# EasyEDA Pro project ProPrj_E24_5.0.epro, board PCB
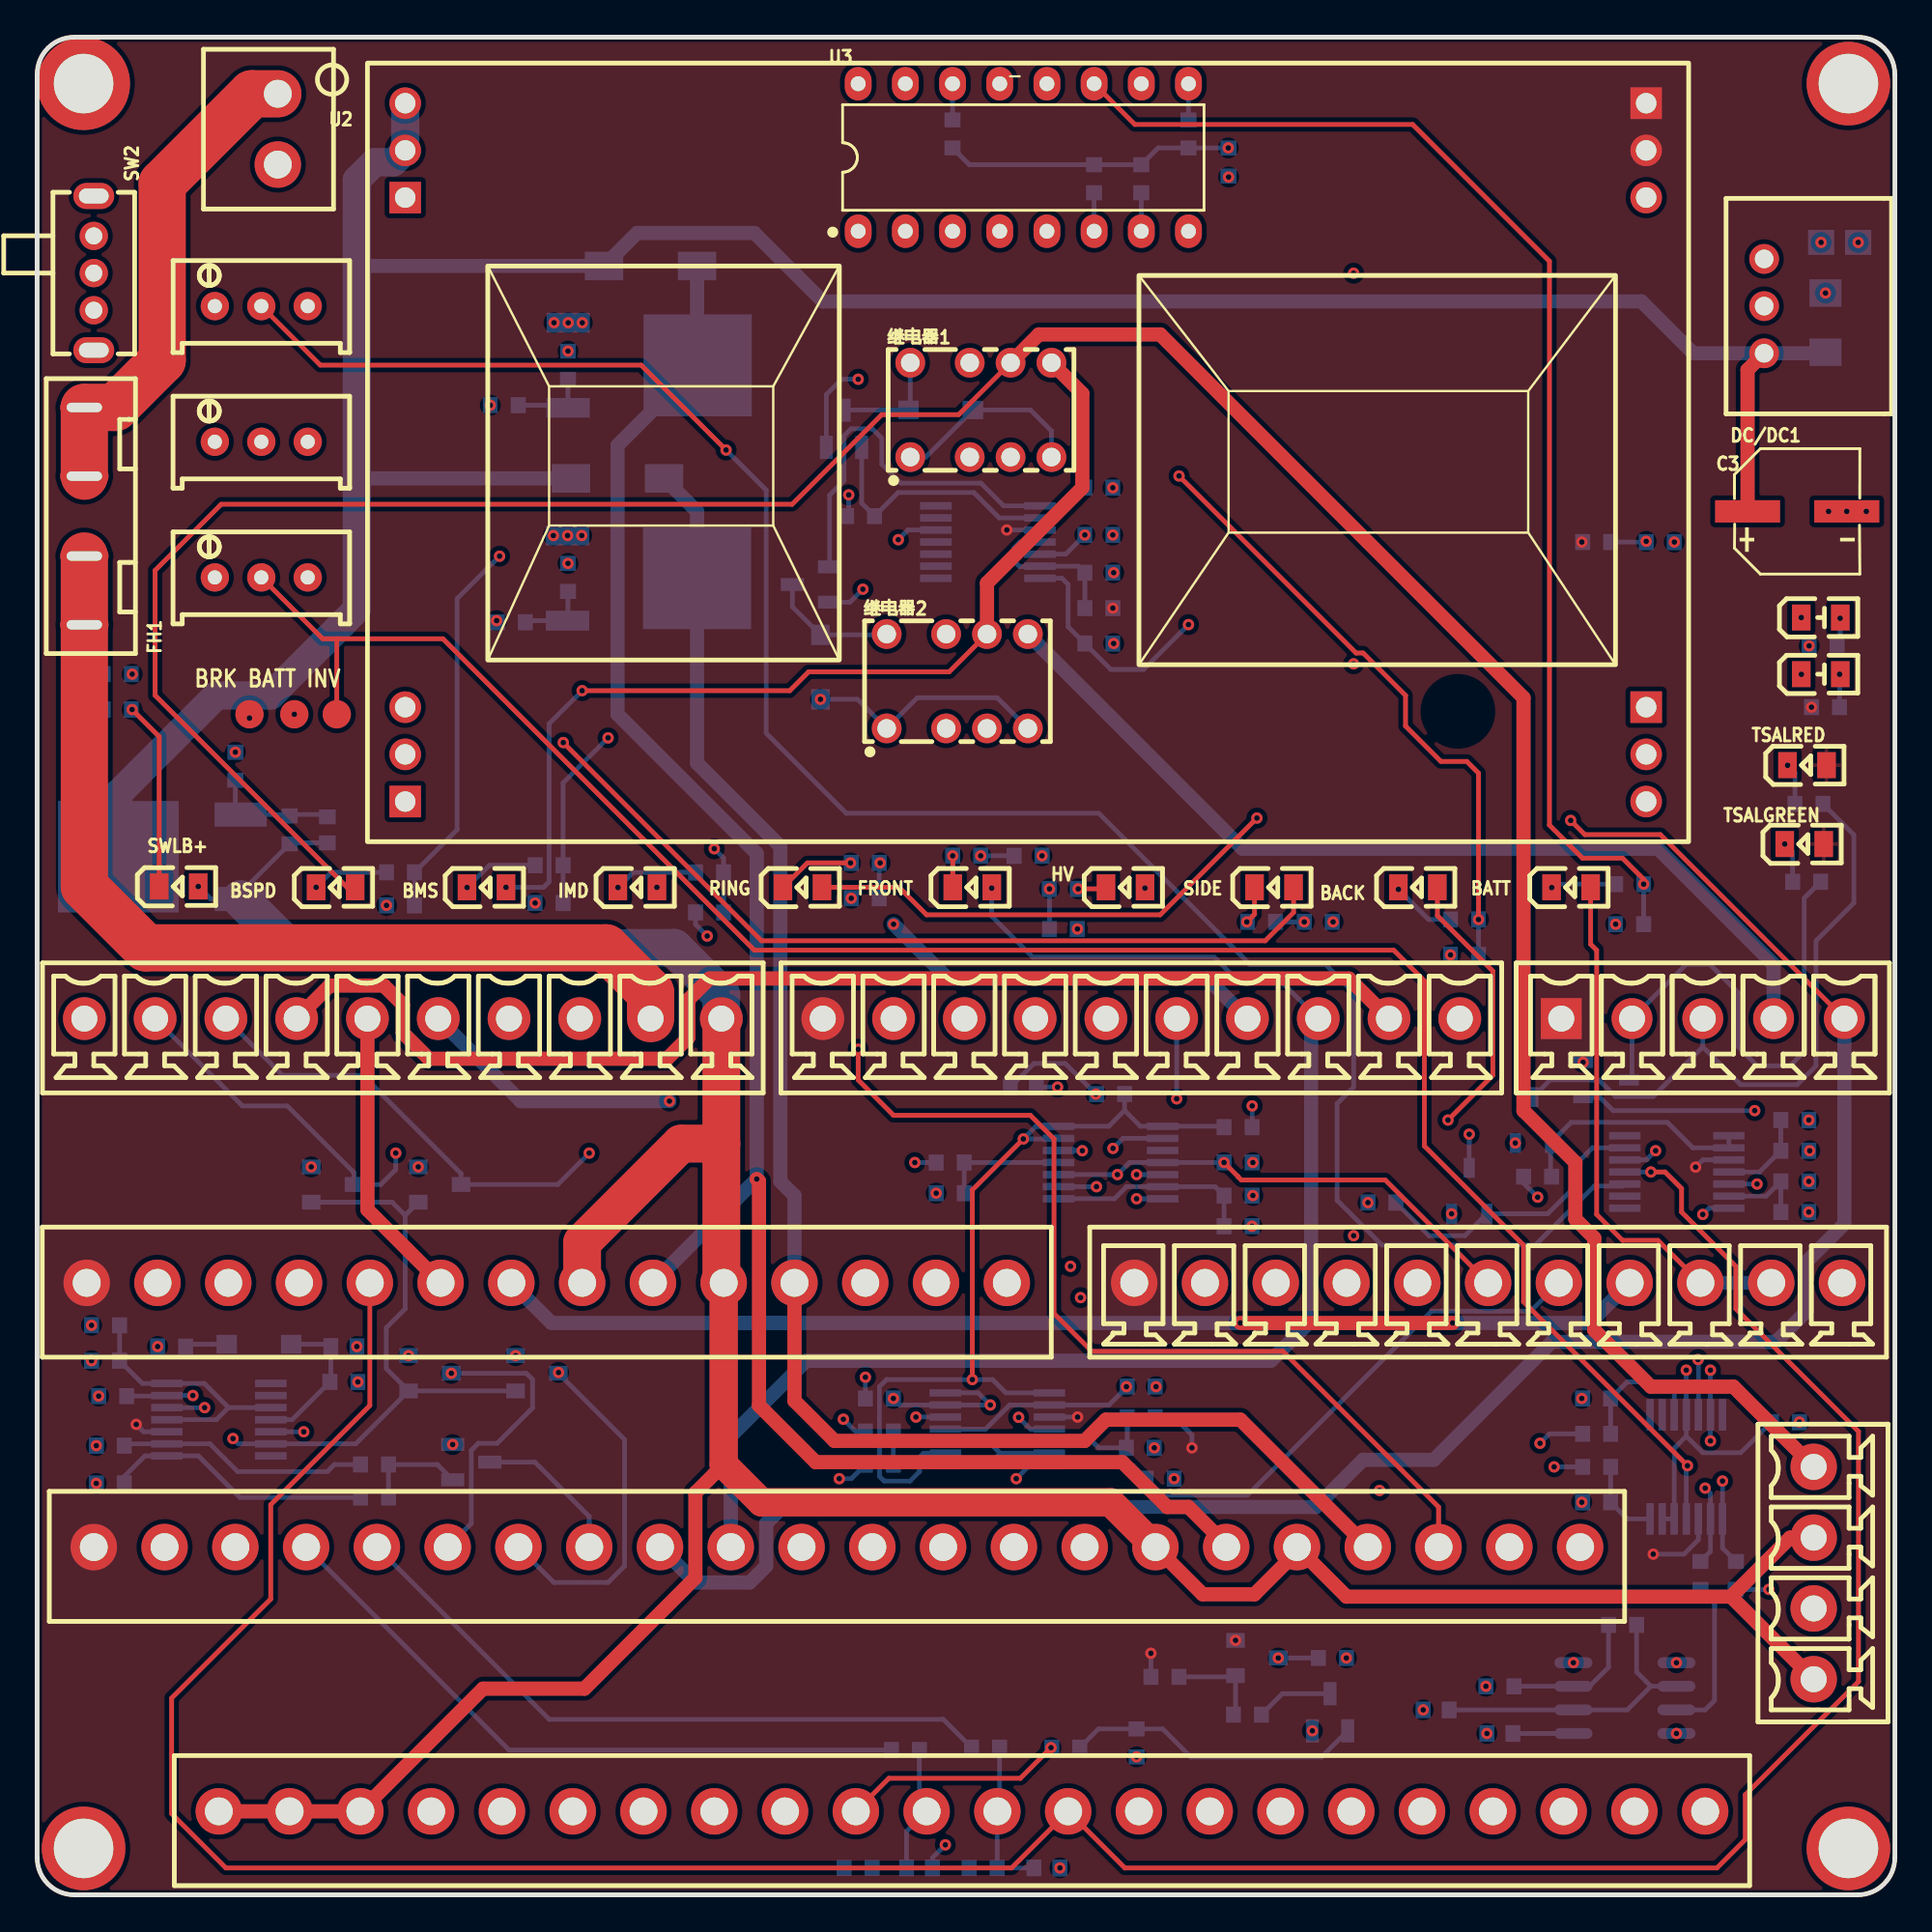
[diagram p3: board, top side]
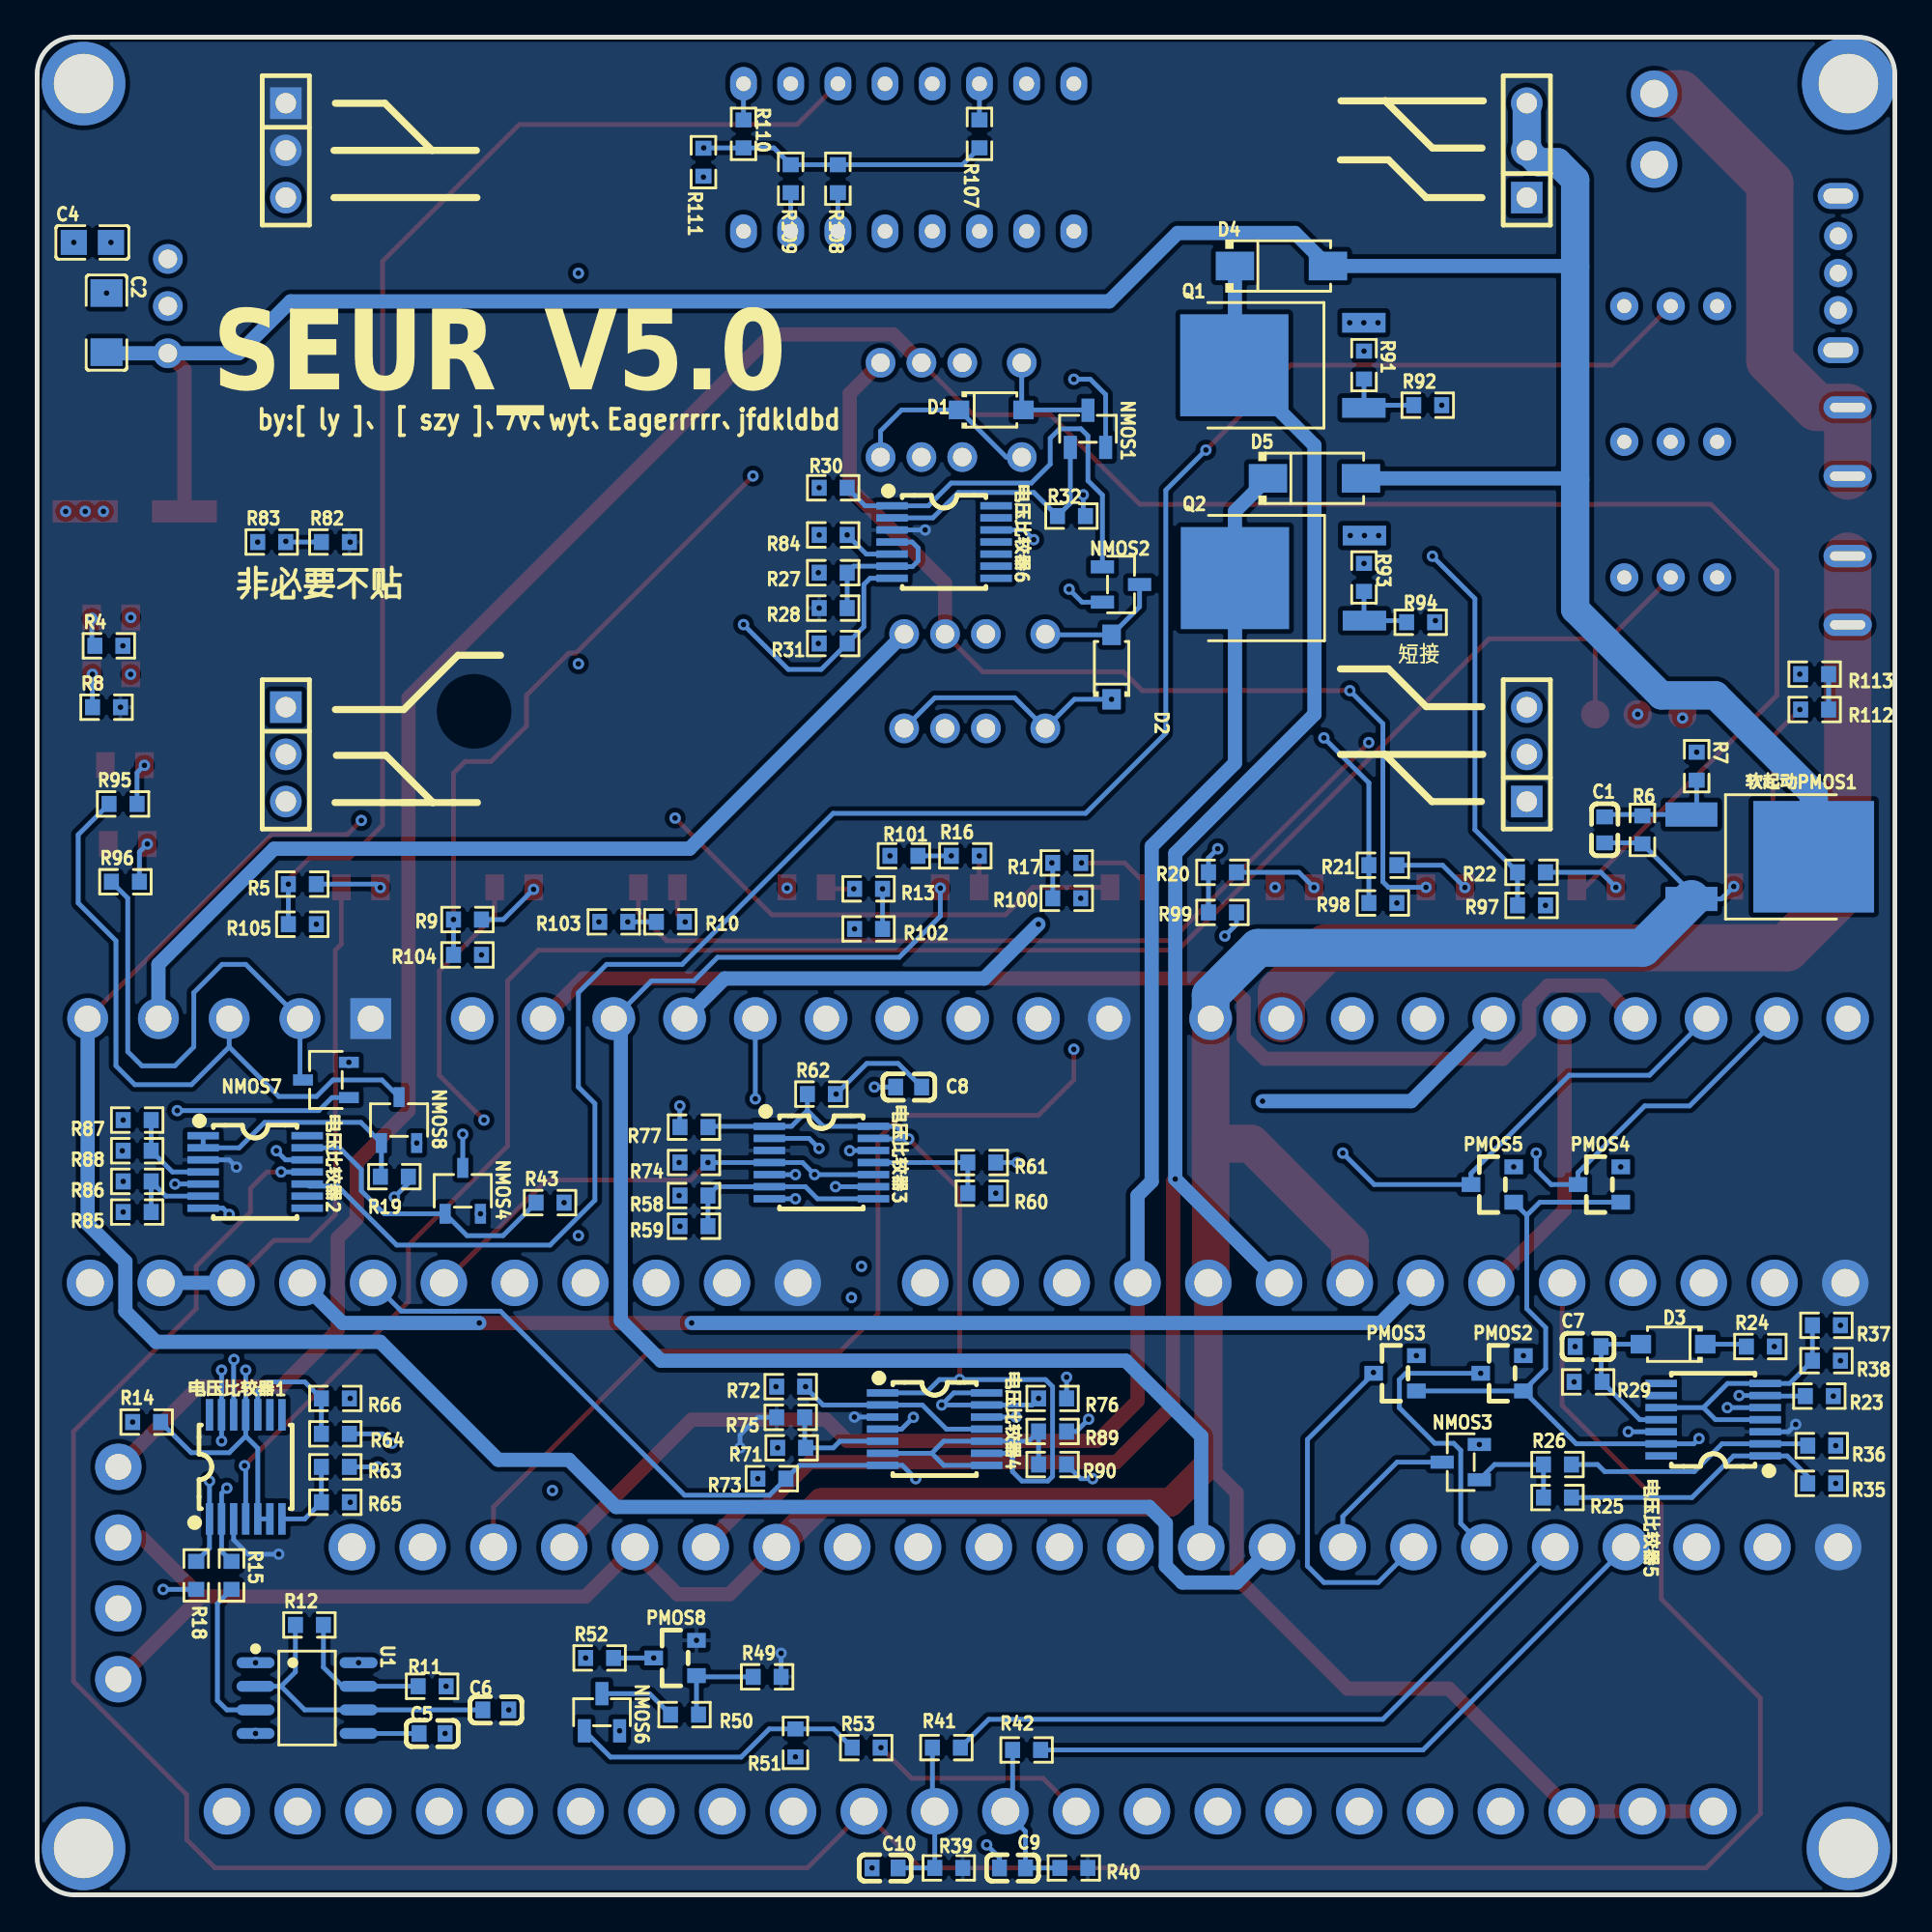
[diagram p4: board, bottom side, seen from below]

Outline 100 x 100 mm; copper layers: Top Layer, Inner1, Inner2, Bottom Layer. Coordinates in mm from the lower left corner of the outline.
Outline path: 0,98 0,2 arc(0.59,0.59) 2,0 98,0 arc(99.41,0.59) 100,2 100,98 arc(99.41,99.41) 98,100 2,100 arc(0.59,99.41) 0,98
Stack: Top Layer 0.035mm 外层铜厚1oz / Dielectric1 0.2104mm 7628 RC49% 8.6mil / Inner1 0.0152mm 内层铜厚 / Dielectric2 1.065mm 1.1mm H/HOZ Copper / Inner2 0.0152mm 内层铜厚 / Dielectric3 0.2104mm 7628 RC49% 8.6mil / Bottom Layer 0.035mm 外层铜厚1oz

## Design rules (mm)
template: JLCPCB Capability(Two Layers Board)
spacing copperThickness1oz (default): track to track 0.102, other pairs 0.152 to 0.3
spacing copperThickness2oz: track to track 0.203, other pairs 0.152 to 0.3
track width copperThickness1oz (default): min 0.127, default 0.254, max 2.54
track width copperThickness2oz: min 0.203, default 0.254, max 2.54
differential pair differentialPair (default): width min 0.127, default 0.254, max 2.54; gap min 0.152, default 0.152
via viaSize (default): diameter min 0.5, default 0.61, max 10; hole min 0.3, default 0.305, max 6.3

## Placement (name value [footprint] x y rotation side)
BACK  09  [LED0805-R-RD]  74.32 54.23 0 top
BATT  10  [LED0805-R-RD]  82.57 54.23 0 top
BMS  03  [LED0805-R-RD]  24.19 54.23 0 top
BSPD  02  [LED0805-R-RD]  16.07 54.23 0 top
C1  10uF  [C0603]  15.62 57.33 270 bottom
C2  10uF  [C1206]  96.27 84.63 270 bottom
C3  33uF  [CAP-SMD_BD6.3-L6.6-W6.6-FD]  94.74 74.47 0 top
C4  22uF  [C0805]  97.03 88.95 180 bottom
C5  10nF  [C0603]  78.74 8.69 0 bottom
C6  1uF  [C0603]  75.31 9.96 0 bottom
C7  10uF  [C0603]  16.51 29.51 180 bottom
C8  1uF  [C0603]  53.09 43.48 0 bottom
C9  10uF  [C0603]  47.5 1.45 0 bottom
C10  10uF  [C0603]  54.36 1.45 0 bottom
CN1  PLUG_FRONT  [CONN-TH_22P-P3.81_DB2EVC-3.81-22P-GN]  43.05 18.72 0 top
CN2  PLUG_BACK  [CONN-TH_14P-P3.81_DB2EVC-3.81-14P-GN]  27.43 32.94 0 top
CN4  PLUG_RING  [CONN-TH_5P-P3.81_DB2EVC-3.81-5P]  89.66 47.17 0 top
CN5  PLUG_SIDE  [CONN-TH_10P-P3.81_DB2EVC-3.81-10P]  19.69 47.17 0 top
CN6  PLUG_BATT  [CONN-TH_11P-P3.81_DB2EVC-3.81-11P-GN]  78.1 32.94 0 top
CN7  LOW_BATT  [CONN-TH_2P-P3.81_DB2EVC-3.81-2P-BK]  12.95 95.05 270 top
CN9  PLUG_BSPD  [CONN-TH_4P-P3.81_DB2EVC-3.81-4P]  95.63 17.32 90 top
CN10  PLUG_VCU  [CONN-TH_22P-P3.81_DB2EVC-3.81-22P-GN]  49.78 4.5 0 top
CN11  PLUG_HV  [CONN-TH_10P-P3.81_DB2EVC-3.81-10P]  59.44 47.17 0 top
D1  1N4148W  [SOD-123F_L2.7-W1.6-LS3.8-RD]  48.64 79.93 180 bottom
D2  1N4148W  [SOD-123F_L2.7-W1.6-LS3.8-RD]  42.16 66.09 90 bottom
D3  1N4148W  [SOD-123F_L2.7-W1.6-LS3.8-RD]  11.94 29.64 0 bottom
D4  SS54  [SMA_L4.4-W2.8-LS5.4-R-RD]  33.02 87.68 180 bottom
D5  SS54  [SMA_L4.4-W2.8-LS5.4-R-RD]  31.24 76.25 180 bottom
DC/DC1  K7805-2000R3  [PWRM-TH_DEXU_K78XX-2000R3]  92.96 85.52 90 top
FH1  FUSE  [FUSE-TH_XF-506P]  2.54 74.22 90 top
FRONT  06  [LED0805-R-RD]  50.34 54.23 0 top
HV  07  [LED0805-R-RD]  58.59 54.23 0 top
IMD  04  [LED0805-R-RD]  32.31 54.23 0 top
LED1  +5V  [LED0805-R-RD_BLUE]  96.01 68.76 0 top
LED2  +24V  [LED0805-R-RD_BLUE]  96.01 65.71 0 top
NMOS1  2N7002  [SOT-23-3_L2.9-W1.3-P1.90-LS2.4-BR]  43.43 78.92 270 bottom
NMOS2  2N7002  [SOT-23-3_L2.9-W1.3-P1.90-LS2.4-BR]  41.66 70.54 0 bottom
NMOS3  2N7002  [SOT-23-3_L2.9-W1.3-P1.90-LS2.4-BR]  23.37 23.29 180 bottom
NMOS4  WST4040  [SOT-23-3_L2.9-W1.6-P1.90-LS2.8-BR]  77.09 37.9 270 bottom
NMOS6  2N7002  [SOT-23-3_L2.9-W1.3-P1.90-LS2.4-BR]  69.6 9.83 270 bottom
NMOS7  WST4040  [SOT-23-3_L2.9-W1.6-P1.90-LS2.8-BR]  84.46 43.87 180 bottom
NMOS8  WST4040  [SOT-23-3_L2.9-W1.6-P1.90-LS2.8-BR]  80.52 41.71 270 bottom
NOREF  -  [Pad_e325]  97.5 97.5 0 top
NOREF#2  -  [Pad_e121]  13.84 63.55 0 top
NOREF#3  -  [Pad_e326]  2.5 2.5 0 top
NOREF#4  -  [Pad_e327]  97.5 2.5 0 top
NOREF#5  -  [Pad_e38]  16.13 63.55 0 top
NOREF#6  -  [Pad_e122]  11.43 63.55 0 top
NOREF#7  -  [Pad_e324]  2.5 97.5 0 top
PMOS2  LBSS84LT1G  [SOT-23_L2.9-W1.3-P1.90-LS2.4-BR]  21.14 28.08 180 bottom
PMOS3  LBSS84LT1G  [SOT-23_L2.9-W1.3-P1.90-LS2.4-BR]  26.91 28.08 180 bottom
PMOS4  LBSS84LT1G  [SOT-23_L2.9-W1.3-P1.90-LS2.4-BR]  15.9 38.24 180 bottom
PMOS5  LBSS84LT1G  [SOT-23_L2.9-W1.3-P1.90-LS2.4-BR]  21.67 38.24 180 bottom
PMOS8  LBSS84LT1G  [SOT-23_L2.9-W1.3-P1.90-LS2.4-BR]  65.66 12.75 180 bottom
Q1  STN454D  [TO-252-2_L6.5-W6.1-P4.58-LS10.0-BR]  32.07 82.34 180 bottom
Q2  STN454D  [TO-252-2_L6.5-W6.1-P4.58-LS10.0-BR]  32.04 70.88 180 bottom
R4  2kΩ  [R0603]  96.14 67.23 180 bottom
R5  10kΩ  [R0603]  85.72 54.41 180 bottom
R6  150kΩ  [R0603]  13.59 57.33 270 bottom
R7  150kΩ  [R0603]  10.67 60.76 270 bottom
R8  10kΩ  [R0603]  96.27 63.93 180 bottom
R9  10kΩ  [R0603]  76.84 52.5 180 bottom
R10  10kΩ  [R0603]  65.91 52.38 180 bottom
R11  22kΩ  [R0603]  78.74 11.23 180 bottom
R12  220kΩ  [R0603]  85.34 14.53 180 bottom
R13  10kΩ  [R0603]  55.25 54.15 0 bottom
R14  100kΩ  [R0603]  94.11 25.45 180 bottom
R15  100kΩ  [R0603]  89.53 17.2 270 bottom
R16  10kΩ  [R0603]  50.04 55.93 180 bottom
R17  10kΩ  [R0603]  44.58 55.55 180 bottom
R18  10kΩ  [R0603]  91.44 17.2 270 bottom
R19  100kΩ  [R0603]  80.77 38.66 180 bottom
R20  10kΩ  [R0603]  36.19 55.04 180 bottom
R21  10kΩ  [R0603]  27.56 55.42 180 bottom
R22  10kΩ  [R0603]  19.56 55.04 180 bottom
R23  10kΩ  [R0603]  4.06 26.85 180 bottom
R24  680Ω  [R0603]  7.24 29.51 180 bottom
R25  300kΩ  [R0603]  18.16 21.39 0 bottom
R26  300kΩ  [R0603]  18.16 23.16 180 bottom
R27  300kΩ  [R0603]  57.15 71.17 180 bottom
R28  100kΩ  [R0603]  57.15 69.27 0 bottom
R29  100kΩ  [R0603]  16.51 27.61 0 bottom
R30  100kΩ  [R0603]  57.15 75.74 0 bottom
R31  100kΩ  [R0603]  57.15 67.36 180 bottom
R32  100kΩ  [R0603]  44.32 74.22 180 bottom
R35  100kΩ  [R0603]  3.94 22.15 180 bottom
R36  100kΩ  [R0603]  3.94 24.18 180 bottom
R37  10kΩ  [R0603]  3.68 30.66 0 bottom
R38  1kΩ  [R0603]  3.68 28.75 180 bottom
R39  2kΩ  [R0603]  50.93 1.45 180 bottom
R40  2kΩ  [R0603]  44.2 1.45 180 bottom
R41  20Ω  [R0603]  51.05 7.93 0 bottom
R42  20Ω  [R0603]  46.74 7.8 0 bottom
R43  100kΩ  [R0603]  72.39 37.26 180 bottom
R49  10kΩ  [R0603]  60.71 11.74 180 bottom
R50  10kΩ  [R0603]  65.15 9.7 180 bottom
R51  10kΩ  [R0603]  59.18 8.18 90 bottom
R52  20kΩ  [R0603]  69.72 12.75 180 bottom
R53  10kΩ  [R0603]  55.37 7.93 180 bottom
R58  330Ω  [R0603]  64.64 37.64 180 bottom
R59  10kΩ  [R0603]  64.64 35.99 0 bottom
R60  10kΩ  [R0603]  49.15 37.77 0 bottom
R61  1kΩ  [R0603]  49.15 39.42 180 bottom
R62  330kΩ  [R0603]  57.78 43.1 180 bottom
R63  1kΩ  [R0603]  83.95 23.04 180 bottom
R64  10kΩ  [R0603]  83.95 24.82 180 bottom
R65  10kΩ  [R0603]  83.95 21.13 0 bottom
R66  330Ω  [R0603]  83.95 26.72 0 bottom
R71  300kΩ  [R0603]  59.39 24.06 180 bottom
R72  10kΩ  [R0603]  59.44 27.36 0 bottom
R73  100kΩ  [R0603]  60.45 22.4 180 bottom
R74  100kΩ  [R0603]  64.64 39.42 180 bottom
R75  100kΩ  [R0603]  59.44 25.71 0 bottom
R76  100kΩ  [R0603]  45.34 26.72 180 bottom
R77  10kΩ  [R0603]  64.64 41.33 0 bottom
R82  ？  [R0603]  83.95 72.82 180 bottom
R83  ？  [R0603]  87.38 72.82 180 bottom
R84  300kΩ  [R0603]  57.15 73.2 180 bottom
R85  1kΩ  [R0603]  94.62 36.75 0 bottom
R86  10kΩ  [R0603]  94.62 38.41 180 bottom
R87  10kΩ  [R0603]  94.62 41.71 0 bottom
R88  330Ω  [R0603]  94.62 40.06 180 bottom
R89  1kΩ  [R0603]  45.34 24.94 180 bottom
R90  10kΩ  [R0603]  45.34 23.16 0 bottom
R91  10kΩ  [R0603]  28.57 82.35 270 bottom
R92  10kΩ  [R0603]  25.15 80.19 180 bottom
R93  10kΩ  [R0603]  28.57 70.92 270 bottom
R94  ？  [R0603]  25.53 68.5 180 bottom
R95  10kΩ  [R0603]  95.38 58.72 180 bottom
R96  10kΩ  [R0603]  95.25 54.53 180 bottom
R97  2kΩ  [R0603]  19.56 53.26 0 bottom
R98  2kΩ  [R0603]  27.56 53.39 0 bottom
R99  2kΩ  [R0603]  36.19 52.88 0 bottom
R100  2kΩ  [R0603]  44.58 53.64 0 bottom
R101  2kΩ  [R0603]  53.34 55.93 180 bottom
R102  2kΩ  [R0603]  55.25 51.99 180 bottom
R103  2kΩ  [R0603]  68.96 52.38 180 bottom
R104  2kΩ  [R0603]  76.84 50.6 0 bottom
R105  2kΩ  [R0603]  85.72 52.25 0 bottom
R107  10kΩ  [R0603]  49.28 94.79 90 bottom
R108  20kΩ  [R0603]  56.9 92.38 90 bottom
R109  40kΩ  [R0603]  59.44 92.38 90 bottom
R110  80kΩ  [R0603]  61.98 94.79 270 bottom
R111  100kΩ  [R0603]  64.13 93.27 90 bottom
R112  10kΩ  [R0603]  4.32 63.81 0 bottom
R113  2kΩ  [R0603]  4.32 65.71 180 bottom
RING  05  [LED0805-R-RD]  41.19 54.23 0 top
SIDE  08  [LED0805-R-RD]  66.58 54.23 0 top
SW2  SK12D07VG4  [SW-TH_SK12D07VG4]  3.05 87.3 270 top
SWLB+  02  [LED0805-R-RD]  7.62 54.28 0 top
TSALGREEN  NCD0805G1  [LED0805-R-RD]  95.12 56.57 0 top
TSALRED  NCD0805R1  [LED0805-R-RD]  95.27 60.81 0 top
U1  -  [SOIC-8_L4.9-W3.9-P1.27-LS6.0-BL]  85.47 10.59 270 bottom
U2  -  [DCDC_b_package]  17.78 98.6 0 top
U3  SN74LS147N(LX)  [PDIP-16_L19.3-W6.4-P2.54-LS7.94-BL]  53.09 93.52 0 top
可调电阻1  10kΩ  [RES-ADJ-TH_3P-L10.0-W10.0-P2.50-L]  12.06 78.22 0 top
可调电阻2  10kΩ  [RES-ADJ-TH_3P-L10.0-W10.0-P2.50-L]  12.06 70.92 0 top
可调电阻3  10kΩ  [RES-ADJ-TH_3P-L10.0-W10.0-P2.50-L]  12.06 85.52 0 top
电压比较器1  LM339PT  [TSSOP-14_L5.0-W4.4-P0.65-LS6.4-BL]  88.77 23.04 180 bottom
电压比较器2  LM339PT  [TSSOP-14_L5.0-W4.4-P0.65-LS6.4-BL]  88.26 38.91 270 bottom
电压比较器3  LM339PT  [TSSOP-14_L5.0-W4.4-P0.65-LS6.4-BL]  57.78 39.42 270 bottom
电压比较器4  LM339PT  [TSSOP-14_L5.0-W4.4-P0.65-LS6.4-BL]  51.69 25.07 270 bottom
电压比较器5  LM339PT  [TSSOP-14_L5.0-W4.4-P0.65-LS6.4-BL]  9.78 25.58 90 bottom
电压比较器6  LM339PT  [TSSOP-14_L5.0-W4.4-P0.65-LS6.4-BL]  51.18 72.82 270 bottom
继电器1  BMS  [RELAY-TH_HFDXXX]  50.8 79.93 0 top
继电器2  IMD  [RELAY-TH_HFDXXX]  49.53 65.33 0 top
软起动PMOS1  NCE40P70K  [TO-252-2_L6.6-W6.1-P4.57-LS9.9-TL-CW]  7.66 55.88 180 bottom

## Footprints (pads in the part's own frame, mm; a bottom-side part is the same pattern mirrored in y, then rotated)
C0603
  rect 0.8x0.9 smd: 1(-0.7,0) 2(0.7,0)
C0805
  rect 1.41x1.35 smd: 1(-1,0) 2(1,0)
C1206
  rect 1.485x1.728 smd: 1(-1.593,0) 2(1.593,0)
CAP-SMD_BD6.3-L6.6-W6.6-FD
  rect 3.5x1.2 smd: 1(-2.67,0) 2(2.67,0)
CONN-TH_2P-P3.81_DB2EVC-3.81-2P-BK
  round 2.5 hole 1.5: 1(-1.905,0) 2(1.905,0)
CONN-TH_4P-P3.81_DB2EVC-3.81-4P
  round 2.5 hole 1.4: 1(-5.715,0) 2(-1.905,0) 3(1.905,0) 4(5.715,0)
CONN-TH_5P-P3.81_DB2EVC-3.81-5P
  rect 2.2x2.2 hole 1.4: 1(-7.62,0)
  round 2.2 hole 1.4: 2(-3.81,0) 3(0,0) 4(3.81,0) 5(7.62,0)
CONN-TH_10P-P3.81_DB2EVC-3.81-10P
  round 2.3 hole 1.4: 1(-17.145,0) 2(-13.335,0) 3(-9.525,0) 4(-5.715,0) 5(-1.905,0) 6(1.905,0) 7(5.715,0) 8(9.525,0) 9(13.335,0) 10(17.145,0)
CONN-TH_11P-P3.81_DB2EVC-3.81-11P-GN
  round 2.5 hole 1.5: 1(-19.05,0) 2(-15.24,0) 3(-11.43,0) 4(-7.62,0) 5(-3.81,0) 6(0,0) 7(3.81,0) 8(7.62,0) 9(11.43,0) 10(15.24,0) 11(19.05,0)
CONN-TH_14P-P3.81_DB2EVC-3.81-14P-GN
  round 2.5 hole 1.5: 1(-24.765,0) 2(-20.955,0) 3(-17.145,0) 4(-13.335,0) 5(-9.525,0) 6(-5.715,0) 7(-1.905,0) 8(1.905,0) 9(5.715,0) 10(9.525,0) 11(13.335,0) 12(17.145,0) 13(20.955,0) 14(24.765,0)
CONN-TH_22P-P3.81_DB2EVC-3.81-22P-GN
  round 2.5 hole 1.5: 1(-40.005,0) 2(-36.195,0) 3(-32.385,0) 4(-28.575,0) 5(-24.765,0) 6(-20.955,0) 7(-17.145,0) 8(-13.335,0) 9(-9.525,0) 10(-5.715,0) 11(-1.905,0) 12(1.905,0) 13(5.715,0) 14(9.525,0) 15(13.335,0) 16(17.145,0) 17(20.955,0) 18(24.765,0) 19(28.575,0) 20(32.385,0) 21(36.195,0) 22(40.005,0)
DCDC_b_package
  round 1.7 hole 1.1: 1(2.032,-2.159) 2(2.032,-4.699) 4(2.032,-34.671) 5(2.032,-37.211) 8(68.834,-4.699) 9(68.834,-7.239) 11(68.834,-37.211) 12(68.834,-39.751)
  rect 1.7x1.7 hole 1.1: 3(2.032,-7.239) 6(2.032,-39.751) 7(68.834,-2.159) 10(68.834,-34.671)
FUSE-TH_XF-506P
  oval 1.2x2.6 hole 0.5x1.9: 1(-5.85,0) 1(-2.15,0) 2(2.15,0) 2(5.85,0)
LED0805-R-RD
  rect 1x1.399 smd: 1(1.05,0) 2(-1.05,0)
LED0805-R-RD_BLUE
  rect 1x1.399 smd: 1(1.05,0) 2(-1.05,0)
Pad_e38
  round 1.524 smd: 1(0,0)
Pad_e121
  round 1.524 smd: 1(0,0)
Pad_e122
  round 1.524 smd: 1(0,0)
Pad_e324
  round 5 hole 3.2: 1(0,0)
Pad_e325
  round 4.5 hole 3.2: 2(0,0)
Pad_e326
  round 4.5 hole 3.2: 3(0,0)
Pad_e327
  round 4.5 hole 3.2: 4(0,0)
PDIP-16_L19.3-W6.4-P2.54-LS7.94-BL
  oval 1.44x1.8 hole 0.8: 1(-8.89,-3.97) 2(-6.35,-3.97) 3(-3.81,-3.97) 4(-1.27,-3.97) 5(1.27,-3.97) 6(3.81,-3.97) 7(6.35,-3.97) 8(8.89,-3.97) 9(8.89,3.97) 10(6.35,3.97) 11(3.81,3.97) 12(1.27,3.97) 13(-1.27,3.97) 14(-3.81,3.97) 15(-6.35,3.97) 16(-8.89,3.97)
PWRM-TH_DEXU_K78XX-2000R3
  round 1.6 hole 1: 1(-2.54,0) 2(0,0) 3(2.54,0)
R0603
  rect 0.806x0.864 smd: 1(-0.753,0) 2(0.753,0)
RELAY-TH_HFDXXX
  round 1.6 hole 1: 1(-3.8,-2.54) 2(-0.6,-2.54) 3(1.6,-2.54) 4(3.8,-2.54) 5(3.8,2.54) 6(1.6,2.54) 7(-0.6,2.54) 8(-3.8,2.54)
RES-ADJ-TH_3P-L10.0-W10.0-P2.50-L
  round 1.524 hole 0.762: 1(-2.5,0) 2(0,0) 3(2.5,0)
SMA_L4.4-W2.8-LS5.4-R-RD
  rect 2.062x1.539 smd: 1(2.503,0) 2(-2.503,0)
SOD-123F_L2.7-W1.6-LS3.8-RD
  rect 1.1x1 smd: 1(-1.735,0) 2(1.735,0)
SOIC-8_L4.9-W3.9-P1.27-LS6.0-BL
  oval 0.588x2.045 smd: 1(-1.905,-2.772) 2(-0.635,-2.772) 3(0.635,-2.772) 4(1.905,-2.772) 5(1.905,2.772) 6(0.635,2.772) 7(-0.635,2.772) 8(-1.905,2.772)
SOT-23-3_L2.9-W1.3-P1.90-LS2.4-BR
  rect 1.25x0.7 smd: 1(1,-0.95) 2(1,0.95) 3(-1,0)
SOT-23-3_L2.9-W1.6-P1.90-LS2.8-BR
  rect 1.07x0.6 smd: 1(1.235,-0.95) 2(1.235,0.95) 3(-1.235,0)
SOT-23_L2.9-W1.3-P1.90-LS2.4-BR
  rect 1x0.8 smd: 1(1.15,-0.95) 2(1.15,0.95) 3(-1.15,0)
SW-TH_SK12D07VG4
  round 1.524 hole 0.914: 1(-2,0) 2(0,0) 3(2,0)
  oval 1.4x2.2 hole 0.8x1.6: 4(4.15,0) 5(-4.15,0)
TO-252-2_L6.5-W6.1-P4.58-LS10.0-BR
  rect 2.336x1.064 smd: 1(3.486,-2.29) 3(3.486,2.29)
  rect 5.826x5.491 smd: 4(-3.486,0)
TO-252-2_L6.6-W6.1-P4.57-LS9.9-TL-CW
  rect 2.8x1.3 smd: 1(-3.292,2.273) 3(-3.292,-2.273)
  rect 6.5x6 smd: 2(3.292,0)
TSSOP-14_L5.0-W4.4-P0.65-LS6.4-BL
  rect 0.4x1.7 smd: 1(-1.95,-2.8) 2(-1.3,-2.8) 3(-0.65,-2.8) 4(0,-2.8) 5(0.65,-2.8) 6(1.3,-2.8) 7(1.95,-2.8) 8(1.95,2.8) 9(1.3,2.8) 10(0.65,2.8) 11(0,2.8) 12(-0.65,2.8) 13(-1.3,2.8) 14(-1.95,2.8)

## Nets
As in the schematic, except:
BATT_VOLT_REF: NOREF#2.1 可调电阻1.2 电压比较器3.5
BRAKE_VOLT_REF: NOREF#6.1 可调电阻3.2 电压比较器2.10
INVERTER_VOLT_REF: NOREF#5.1 可调电阻2.2 电压比较器1.4

Pads without a net: CN1 22; CN2 12 13 14; NOREF 2; NOREF#3 3; NOREF#4 4; NOREF#7 1; SW2 1; U3 15; 电压比较器1 8 9 14; 电压比较器2 8 9 14; 电压比较器5 8 9 14; 电压比较器6 8 9 10 11 13 14; 继电器1 7; 继电器2 7

## Via types
v1: diameter 0.61, hole 0.305, Top Layer to Bottom Layer, 197 vias

## Routing (per net, layer and track width the routed paths; a pad name or vN(x,y) marks a point on that pad's centre or on a via; arc(x,y) is an arc through that point)
+0.16V_1: length 7.2
  Bottom Layer w0.254: 电压比较器1.10 88.12,27.12 87.63,27.61 85.59,27.61 R66.2 R64.1
+0.16V_2: length 4.9
  Bottom Layer w0.254: 电压比较器2.4 92.72,38.91 R88.2 R87.1
+0.16V_3: length 11
  Bottom Layer w0.254: 电压比较器3.8 57.99,37.47 58.64,38.12 63.41,38.12 R58.2 R59.1
+4.55V_1: length 4.4
  Bottom Layer w0.254: 电压比较器1.7 85.6,20.24 R65.2 R63.1
+4.55V_2: length 4.8
  Bottom Layer w0.254: R85.1 R86.2 93.07,37.61 电压比较器2.6
+4.55V_3: length 6.7
  Bottom Layer w0.254: R60.2 R61.1 电压比较器3.11
+4.55V_4: length 13.9
  Bottom Layer w0.254: 51.85,23.77 电压比较器4.6 ; 51.85,23.77 51.2,24.42 电压比较器4.10 46.62,24.42 R89.1 R90.2 ; 51.85,23.77 51.2,23.12 电压比较器4.8
+4.55V_5: length 14.7
  Bottom Layer w0.254: 电压比较器5.4 9.65,25.58 10.3,26.23 ; 10.3,26.23 9,27.53 电压比较器5.7 5.66,27.53 R38.1 R37.2 ; 10.3,26.23 电压比较器5.10
+5V: length 14.5
  Bottom Layer w0.254: R19.2 80.02,38.31 v1(80.77,37.56) ; R63.2 v1(81.66,23.04) ; v1(43.4,25.6) 44.06,24.94 R89.2 ; R32.2 43.69,74.34 v1(43.69,75.36) ; v1(80.9,24.31) 81.41,24.82 R64.2 ; v1(44.59,27.86) R76.2 ; R61.2 v1(47.24,39.42) ; R18.2 v1(93.22,16.44) ; C8.2 54.93,43.48 v1(54.93,43.48) ; v1(65.41,42.47) 65.41,41.33 R77.2
  vias: v1(2.93,28.75) v1(3.18,24.18) v1(3.18,22.15) v1(3.31,26.85) v1(6.49,29.51) v1(14.75,39.19) v1(17.26,27.61) v1(19.99,29.03) v1(20.52,39.19) v1(25.76,29.03) v1(57.9,75.74) v1(60.23,27.36) v1(65.4,35.99) v1(71.64,37.26) v1(77.99,11.23) v1(82.7,12.5) v1(88.24,8.69) v1(95.39,67.23) v1(95.37,41.71) v1(95.37,36.75) v1(96.03,88.95)
+18V_1: length 6
  Bottom Layer w0.254: R75.1 58.68,24.11 R71.2 57.14,24.06 56.78,24.42 电压比较器4.5
+18V_2: length 8.2
  Bottom Layer w0.254: R28.1 R27.2 56.05,71.52 53.98,71.52 53.96,71.5 52.88,71.5 52.58,71.81 52.58,72.5 52.9,72.82 53.98,72.82
+24V: length 15.3
  Bottom Layer w0.254: 53.98,73.47 v1(52.2,73.47) ; R75.2 61.21,25.71 62.16,24.76 v1(62.16,24.06) ; v1(89.27,39.17) 89.66,39.56 电压比较器2.3 ; v1(5.33,25.32) 5.73,24.93 电压比较器5.3 ; v1(87,18.34) 88.65,18.34 89.42,19.12 电压比较器1.3 ; 电压比较器4.3 v1(56.01,25.72) ; R49.2 v1(59.95,13)
  vias: v1(57.9,69.27) v1(64.51,13.7) v1(83.15,72.82) v1(95.51,63.93)
GND: length 23.5
  Bottom Layer w0.254: C9.2 48.2,2 v1(48.89,2.69) ; R99.1 35.44,52.24 v1(36.07,51.61) ; v1(56.26,40.06) 56.25,40.07 电压比较器3.12 ; v1(89.41,28.82) 89.42,28.8 电压比较器1.12 ; R90.1 43.82,22.4 v1(43.18,22.4) ; 电压比较器6.12 46.88,73.47 v1(46.35,72.95) ; v1(87.12,40.06) 86.63,39.56 电压比较器2.12 ; NMOS1.2 42.48,80.76 43.31,81.58 v1(44.2,81.58) ; v1(44.45,70.28) 43.75,69.59 NMOS2.2 ; 电压比较器5.12 v1(14.35,24.93) ; 电压比较器4.12 v1(47.31,25.72)
  vias: v1(2.93,30.66) v1(5.12,65.71) v1(10.67,61.51) v1(17.21,29.51) v1(18.8,53.26) v1(22.37,24.24) v1(26.81,53.39) v1(27.82,84.63) v1(27.79,73.17) v1(28.59,84.63) v1(28.57,83.1) v1(28.55,73.17) v1(28.57,71.67) v1(29.35,84.63) v1(29.31,73.17) v1(43.82,53.64) v1(48.4,37.77) v1(54.09,55.93) v1(55.06,1.45) v1(56,51.99) v1(57.9,73.2) v1(57.95,71.17) v1(57.95,67.36) v1(59.18,7.43) v1(60.14,24.06) v1(61.21,22.4) v1(64.13,92.47) v1(65.44,39.42) v1(65.44,37.64) v1(68.65,8.83) v1(69.76,52.38) v1(70.48,12.75) v1(74.61,9.96) v1(76.08,50.6) v1(76.14,36.66) v1(78.04,8.69) v1(79.57,40.47) v1(83.15,26.72) v1(83.15,21.13) v1(83.22,44.82) v1(84.97,52.25) v1(88.13,72.82) v1(88.24,12.5) v1(94.86,25.45) v1(94.96,68.76) v1(94.97,65.7) v1(95.41,40.06) v1(95.37,38.41) v1(96.27,86.23) v1(96.43,74.47) v1(97.41,74.47) v1(98.03,88.95) v1(98.46,74.47)
AIR: length 40.2
  Inner1 w0.254: v1(52.83,25.71) 52.71,25.58 v1(52.71,22.4)
  Bottom Layer w0.254: CN6.7 80.39,31.42 78.74,31.42 78.74,31.41 77.47,31.41 77.47,31.42 75.06,31.42 65.15,21.51 60.58,21.51 58.97,23.12 电压比较器4.7 53.42,23.12 v1(52.71,22.4) ; 电压比较器4.4 53.47,25.07 v1(52.83,25.71)
APPS1: length 24.1
  Inner1 w0.254: CN1.11 51.18,8.69 55.12,8.69 CN10.14
APPS2: length 24.1
  Inner1 w0.254: CN1.12 54.1,9.58 58.04,9.58 CN10.15
BATT_VOLT: length 29.2
  Top Layer w0.254: CN6.6 72.57,38.48 64.82,38.48 64.64,38.66 64.64,38.67 v1(63.89,39.42)
  Inner2 w0.254: v1(58.15,38.77) 58.15,38.5 v1(59.18,37.47)
  Bottom Layer w0.254: 电压比较器3.7 v1(59.18,37.47) ; 电压比较器3.10 v1(58.15,38.77) 58.8,39.42 电压比较器3.4 v1(63.89,39.42)
BATT_VOLT_REF: length 77.8
  Inner2 w0.254: v1(13.84,63.55) 19.6,69.31 19.6,69.35 ; 19.6,69.35 39.12,49.83 39.12,46.79 41.53,44.37 57.28,44.37 59.18,42.47 v1(59.18,38.77) ; 19.6,69.35 12.06,76.89 可调电阻1.2
  Bottom Layer w0.254: 电压比较器3.5 v1(59.18,38.77)
BMS: length 49.5
  Inner1 w0.254: CN6.4 67.06,36.37 67.06,60.25 59.94,67.36 59.94,70.66 58.42,72.19 57.41,72.19 v1(56.4,73.2)
  Bottom Layer w0.254: 53.98,72.17 55.37,72.17 v1(56.4,73.2)
BMS_ERROR: length 79.4
  Inner1 w0.254: 继电器1.2 50.2,71.33 48.13,69.27 43.94,69.27 29.34,54.66 29.34,50.72 27.31,48.69 27.31,38.15 23.62,34.47 23.62,29.39 22.31,28.08 v1(22.29,28.08)
  Bottom Layer w0.254: v1(22.29,28.08) 26.33,28.08 26.67,27.74 26.67,26.21 24.77,24.31 23.75,24.31 23.37,23.93 23.37,19.99 CN1.6
BMS_RESET-: length 77.7
  Inner1 w0.254: 继电器1.1 47,77.03 19.69,49.72 19.69,40.31 v1(19.3,39.93)
  Bottom Layer w0.254: 继电器1.1 47.84,77.39 D1.1 53.47,79.93 54.6,78.8 继电器1.4 ; v1(19.3,39.93) 19.3,39.04 18.5,38.24 PMOS4.3 17.05,38.88 13.46,42.47 11.05,42.47 CN5.2
BRAKE_PEDAL: length 24.1
  Inner1 w0.254: CN1.15 63.75,11.35 67.69,11.35 CN10.18
BRAKE_VOLT_B: length 167
  Top Layer w0.254: v1(86.87,38.91) 87.63,38.91 88.52,38.02 88.52,36.75 91.44,33.83 91.44,31.55 98.04,24.94 98.04,11.48 91.95,5.38 91.95,2.97 90.42,1.45 58.55,1.45 CN10.13 52.45,1.45 10.16,1.45 7.24,4.37 7.24,10.59 12.57,15.93 12.57,21.01 17.91,26.34 CN2.5
  Bottom Layer w0.254: 电压比较器2.11 v1(86.87,38.91)
BRAKE_VOLT_F: length 24.1
  Inner1 w0.254: CN1.13 57.28,10.21 61.21,10.21 CN10.16
BRAKE_VOLT_REF: length 137.5
  Top Layer w0.254: 可调电阻3.2 15.24,82.35 32.51,82.35 v1(37.08,77.78)
  Inner1 w0.254: 可调电阻3.2 6.73,80.19 6.73,68.05 v1(11.43,63.35)
  Bottom Layer w0.254: 85.47,38.26 85.35,38.15 83.82,38.15 80.65,34.98 72.39,34.98 69.98,37.39 69.98,42.6 70.87,43.48 70.87,48.56 69.34,50.09 65.28,50.09 57.15,58.22 43.56,58.22 39.24,62.53 39.24,75.62 v1(37.08,77.78)
BRAKELIGHT-: length 83.3
  Inner1 w0.254: v1(55.63,33.83) 59.56,29.9 79.12,29.9 80.01,30.78 80.01,38.02 v1(77.09,40.94)
  Inner2 w0.254: v1(55.63,33.83) 52.58,30.78 16.26,30.78 14.1,32.94
  Bottom Layer w0.254: NMOS4.3 v1(77.09,40.94)
BUZZER: length 24.1
  Inner1 w0.254: 70.74,4.5 64.39,10.85 60.45,10.85 CN1.14
CLOCK: length 8.6
  Bottom Layer w0.254: 88.24,9.96 89.79,9.96 90.3,10.47 90.3,15.68 R15.2
CURRENT: length 51.1
  Inner2 w0.254: 78.36,4.5 71.88,10.97 71.88,14.66 69.72,16.81 69.72,19.86 68.45,21.13 68.45,34.09 65.66,36.88 63.37,36.88 61.34,38.91 v1(61.34,42.85)
  Bottom Layer w0.254: CN11.6 v1(61.34,42.85)
CURRENT_FOR_INSPECTION: length 53.5
  Inner1 w1.016: v1(34.04,42.72) 36.83,42.72 39.62,45.52 39.62,49.07 42.8,52.25 v1(46.1,52.25)
  Bottom Layer w0.762: v1(34.04,42.72) 26.03,42.72 CN5.6 ; CN11.7 62.99,49.33 49.02,49.33 v1(46.1,52.25)
DCDC_ENABLE: length 65.7
  Inner1 w0.254: CN11.5 55.37,49.33 52.83,49.33 51.82,48.31 51.82,42.47 46.48,37.14 46.48,30.78 39.24,23.55 39.24,16.81 42.16,13.89 42.16,3.23 41.02,2.08 38.86,2.08 CN10.8
DCDC_TEMP: length 53.7
  Inner2 w0.254: 76.58,47.17 87.88,35.86 89.66,35.86 91.44,34.09 91.44,13.77 CN10.20
FAN_PWM-: length 87.6
  Top Layer w0.762: CN1.19 64.77,25.58 57.53,25.58 56.39,24.44 42.93,24.44 40.77,26.59 CN2.11
  Bottom Layer w0.762: CN2.11 40.77,37.64 40,38.41 40,56.44 35.52,60.92 Q2.4 ; 35.52,70.88 35.52,74.47 D5.2
FAN_SWITCH: length 81.2
  Top Layer w0.254: CN1.20 75.44,20.88 67.06,29.26 56.77,29.26 54.74,31.29 54.74,40.69 53.47,41.96 46.1,41.96 44.2,43.87 v1(44.2,45.52)
  Inner2 w0.254: v1(44.2,45.52) 44.2,47.28 24.73,66.75 v1(24.73,68.59)
FUSED_LOW_BATT+: length 52
  Top Layer w2.54: CN5.9 33.02,48.56 30.61,50.98 5.84,50.98 2.54,54.28 FH1.1 FH1.1
GREEN_SCS_NORMAL: length 47.8
  Top Layer w0.254: v1(53.09,40.69) 50.34,37.95 v1(50.34,27.74)
  Bottom Layer w0.254: 58.54,42.22 59.39,41.37 电压比较器3.1 63.84,41.37 R77.1 ; 58.54,42.22 57.69,41.37 电压比较器3.14 53.77,41.37 v1(53.09,40.69) 54.96,40.69 电压比较器3.13 ; 58.54,42.22 R62.1 ; 电压比较器4.1 52.15,27.02 51.44,27.74 v1(50.34,27.74) 45.72,27.74 45.34,27.36 45.34,22.53 45.59,22.28 46.99,22.28 47.5,22.78 47.5,23.55 47.72,23.77 电压比较器4.9
GREENLIGHT_ON: length 27.6
  Inner2 w0.254: v1(58.64,27.36) 57.28,28.72 57.28,34.09 57.91,34.72 57.91,38.15 57.53,38.53 57.53,39.8 v1(57.91,40.18)
  Bottom Layer w0.254: 电压比较器4.11 51.05,25.07 52.35,26.37 电压比较器4.2 57.7,26.37 R72.1 ; v1(57.91,40.18) 58.45,40.72 电压比较器3.2
HV_BUTTON-: length 36
  Bottom Layer w0.254: R42.1 25.4,7.8 CN1.4
HV_ENABLE_IN: length 11.9
  Top Layer w0.254: v1(54.58,7.93) 52.93,6.27 45.85,6.27 CN10.10
HV_ENABLE_OUT: length 22.9
  Inner2 w0.254: v1(66.81,12.75) 66.04,13.52 66.04,22.02 66.68,22.66 66.68,32.94
  Bottom Layer w0.254: R52.2 v1(66.81,12.75)
HV_ENABLE_TO_VCU: length 8.8
  Bottom Layer w0.254: R42.2 47.49,4.89 CN10.11 46.8,3.41 C9.1 R40.1
IMD: length 58.2
  Inner1 w0.254: CN6.5 74.29,41.83 74.68,42.22 74.68,60.63 73.79,61.52 73.79,65.08 70.49,68.38 v1(61.98,68.38)
  Bottom Layer w0.254: 53.98,70.87 55.16,70.87 55.5,70.54 55.5,68.26 R31.2 57.79,65.96 59.56,65.96 v1(61.98,68.38)
IMD_ERROR: length 66.3
  Inner1 w0.254: v1(28.07,28.12) 29.34,28.12 31.24,30.02 31.24,33.58 33.15,35.48 39.12,35.48 48.01,44.37 48.01,61.86 继电器2.2
  Bottom Layer w0.254: CN1.7 27.81,16.81 30.73,16.81 31.62,17.7 31.62,24.51 PMOS3.3
IMD_RESET-: length 67.1
  Inner1 w0.254: v1(42.16,64.36) 42.16,61.14 31.12,50.09 31.12,41.33 v1(29.72,39.93)
  Bottom Layer w0.254: v1(29.72,39.93) 28.03,38.24 PMOS5.3 22.82,38.83 17.53,44.12 13.21,44.12 CN5.3 ; 继电器2.4 51.68,64.44 47.38,64.44 继电器2.1 44.16,64.36 v1(42.16,64.36)
INVERTER_BUTTON-: length 36.5
  Bottom Layer w0.254: R41.1 48.78,9.45 27.56,9.45 CN1.5
INVERTER_ENABLE_TO_VCU: length 8.5
  Bottom Layer w0.254: R41.2 51.81,4.61 CN10.12 51.68,4.49 R39.1 C10.1
INVERTER_VOLT: length 63.6
  Inner2 w0.254: CN11.3 52.2,44.88 61.34,44.88 67.06,39.17 81.79,39.17 87.63,33.33 87.63,29.39 v1(88.77,28.25)
  Bottom Layer w0.254: 88.77,24.69 88.12,24.04 电压比较器1.5 电压比较器1.6 ; 88.77,24.69 电压比较器1.11 v1(88.77,28.25) ; 88.77,24.69 89.66,23.8 91.7,23.8 R14.2
INVERTER_VOLT_REF: length 110.5
  Top Layer w0.254: 16.13,67.61 21.84,67.61 38.61,50.85 73.03,50.85 74.68,49.2 74.68,40.31 80.01,34.98 80.01,31.93 v1(88.84,23.1) ; 16.13,67.61 16.13,67.61 NOREF#5.1 ; 16.13,67.61 15.37,67.61 可调电阻2.2
  Bottom Layer w0.254: 电压比较器1.4 88.77,23.04 v1(88.84,23.1)
LOW_BATT+: length 26.7
  Top Layer w2.54: FH1.2 FH1.2 4.2,80.07 6.73,82.6 6.73,92.13 11.56,96.95 CN7.1
PUMP_ENABLE: length 95.8
  Inner1 w0.254: v1(24.39,80.19) 22.73,78.53 22.73,59.23 16.38,52.88 16.38,47.79 16.35,47.76 16.35,32.34 16.38,32.31 16.38,16.56 20.45,12.5 32.26,12.5 CN10.9
PUMP_PWM-: length 102.6
  Top Layer w0.762: CN1.17 64.01,18.85 61.98,20.88 60.83,20.88 58.42,23.29 41.91,23.29 38.86,26.34 38.86,38.41 v1(38.74,38.53)
  Bottom Layer w0.762: CN2.9 v1(38.74,38.53) 38.74,56.06 31.24,63.55 31.24,78.02 Q1.4 35.52,82.37 D4.2
RED_SCS_NORMAL: length 21.9
  Inner1 w0.254: v1(89.66,36.63) 91.19,35.1 91.19,29.36 v1(90.07,28.25) ; v1(90.07,24.44) 90.07,22.93 v1(90.72,22.28)
  Bottom Layer w0.254: R18.1 90.72,18.67 v1(90.72,22.28) ; v1(89.66,36.63) 90,36.96 电压比较器2.7 ; v1(90.07,24.44) 电压比较器1.13 v1(90.07,28.25)
REDLIGHT_ON: length 24.4
  Inner1 w0.254: v1(89.79,21.9) 90.04,21.64 90.93,21.64 91.69,22.4 91.69,35.61 92.58,36.5 v1(92.58,38.26)
  Bottom Layer w0.254: R15.1 90.07,18.49 电压比较器1.2 90.07,21.61 v1(89.79,21.9) ; 91.06,38.26 v1(92.58,38.26)
SC_02: length 159.3
  Top Layer w0.254: 17.12,54.23 16.68,54.23 6.35,64.57 6.35,71.3 9.91,74.85 40.64,74.85 45.47,79.68 49.61,79.68 继电器1.6
  Top Layer w0.762: 继电器1.6 53.92,84 60.45,84 80.01,64.44 80.01,42.22 82.8,39.42 82.8,36.37 83.82,35.36 83.82,30.4 86.87,27.36 91.31,27.36 CN9.4
SC_02_4V: length 65.8
  Inner1 w0.254: v1(24.89,72.06) 45.47,92.63 54.58,92.63 U3.10
  Bottom Layer w0.254: v1(24.89,72.06) 22.61,69.77 22.61,57.34 R22.1 R97.2
SC_03: length 53.9
  Top Layer w0.254: v1(29.34,64.82) 40.51,64.82 41.53,65.84 49.1,65.84 继电器2.6
  Top Layer w0.762: 继电器1.5 56.26,80.81 56.26,75.74 51.13,70.61 继电器2.6
  Bottom Layer w0.254: v1(25.24,54.23) 27.26,54.23 27.56,54.53 27.56,63.04 v1(29.34,64.82)
SC_03_4V: length 59.2
  Inner2 w0.254: v1(30.73,62.28) 30.73,65.71 39.12,74.09 39.12,90.47 41.53,92.89 51.02,92.89 U3.5
  Bottom Layer w0.254: v1(30.73,62.28) 28.31,59.86 R21.1 R98.2
SC_04: length 77.7
  Inner1 w0.254: v1(33.36,54.23) 41.15,62.02 41.15,64.82 42.16,65.84 51.3,65.84 继电器2.5
  Bottom Layer w0.762: CN4.4 93.47,50.09 87.25,56.31 64.89,56.31 继电器2.5
SC_04_4V: length 53
  Inner2 w0.254: v1(36.45,56.31) 38.86,58.72 38.86,73.2 39.62,73.97 39.62,89.97 42.04,92.38 48.99,92.38 U3.4
  Bottom Layer w0.254: R99.2 R20.1 36.95,55.81 v1(36.45,56.31)
SC_05: length 148.8
  Top Layer w0.254: v1(65.66,57.96) 60.45,52.76 47.88,52.76 46.4,54.23 42.25,54.23 ; CN4.5 87.38,57.07 83.31,57.07 v1(82.55,57.84)
  Inner2 w0.254: v1(65.66,57.96) 65.79,57.84 v1(82.55,57.84)
  Bottom Layer w0.762: CN1.9 35.43,16.81 38.36,16.81 39.24,17.7 39.24,19.99 40.13,20.88 68.83,20.88 71.37,23.42 75.18,23.42 81.53,29.77 93.6,29.77 95.25,31.42 95.25,34.09 97.28,36.12 CN4.5
SC_05_4V: length 49.6
  Inner2 w0.254: v1(45.38,55.55) 39.37,61.56 39.37,72.95 40.32,73.9 40.32,89.52 42.67,91.87 46.96,91.87 U3.3
  Bottom Layer w0.254: R17.1 R100.2
SC_06: length 77.6
  Bottom Layer w0.254: CN11.8 66.93,49.2 64.64,49.2 63.37,50.47 53.59,50.47 51.38,52.68 v1(51.38,54.19)
  Bottom Layer w0.762: CN1.10 37.34,24.69 41.4,28.75 66.42,28.75 68.58,30.91 68.58,46.79 CN11.8
SC_06_4V: length 49.6
  Inner2 w0.254: v1(50.79,55.93) 49.39,57.33 45.97,57.33 39.75,63.55 39.75,72.69 40.89,73.84 40.89,89.33 42.8,91.24 45.05,91.24 U3.2
  Bottom Layer w0.254: R101.2 v1(50.79,55.93)
SC_07: length 82
  Top Layer w0.762: CN11.9 70.61,49.33 36.19,49.33 35.05,48.18 35.05,46.15 33.91,45.01 21.08,45.01 19.69,46.41 19.69,47.93 18.67,48.95 15.75,48.95 CN5.4
  Inner2 w0.254: CN11.9 70.61,49.33 64.5,49.33 v1(59.63,54.19)
SC_07_4V: length 46.6
  Inner2 w0.254: v1(54.49,54.15) 49.67,58.98 45.47,58.98 41.4,63.04 41.4,86.76 U3.1
  Bottom Layer w0.254: v1(54.49,54.15) R102.2
SC_08: length 80.8
  Top Layer w0.254: v1(28.32,62.03) 38.99,51.36 66.11,51.36 67.63,52.88 SIDE.1
  Top Layer w0.762: CN2.6 17.78,36.88 CN5.5
  Inner1 w0.254: CN5.5 17.78,50.85 28.32,61.39 v1(28.32,62.03)
SC_08_4V: length 55.5
  Inner2 w0.254: v1(68.21,52.38) 65.16,55.42 63.12,55.42 55.12,63.42 55.12,75.62 56.13,76.63 56.13,86.79 55.75,87.17 55.75,93.56 U3.13
  Bottom Layer w0.254: R10.1 v1(68.21,52.38)
SC_09: length 88.5
  Top Layer w0.254: v1(75.95,41.71) 78.36,44.12 78.36,49.73 75.37,52.71 BACK.1
  Top Layer w0.762: v1(76.2,30.78) v1(64.77,30.78)
  Inner1 w0.254: v1(75.95,41.71) 75.06,40.82 75.06,34.98 76.2,33.83 v1(76.2,30.78)
  Bottom Layer w0.762: CN2.7 27.69,30.78 v1(64.77,30.78) ; CN6.8 83.57,30.78 v1(76.2,30.78)
SC_09_4V: length 58.1
  Top Layer w0.254: v1(77.59,52.5) 77.59,60.38 76.96,61.01 75.56,61.01 73.66,62.92 73.66,64.57 71.38,66.85 71,66.85 v1(61.47,76.38)
  Inner2 w0.254: v1(61.47,76.38) 58.29,79.55 58.29,94.41 57.66,95.05 56.8,95.05 U3.12
  Bottom Layer w0.254: v1(77.59,52.5) R104.2
SC_10: length 121.8
  Top Layer w0.254: BATT.1 83.62,51.17 83.95,50.85 83.95,36.63 85.34,35.23 87.25,35.23 CN6.9
  Inner1 w0.254: CN11.4 53.72,34.59 v1(56.17,32.15) 59.44,28.88 85.47,28.88 CN6.9
  Inner2 w0.254: v1(56.17,32.15) 50.67,26.66 50.67,16.94 48.9,15.16 43.31,15.16 32.64,4.5
  Bottom Layer w0.762: CN6.10 CN6.9
SC_10_4V: length 67.5
  Top Layer w0.254: v1(86.48,54.41) 86.48,54.67 85.34,55.8 83.19,55.8 81.41,57.58 81.41,87.94 74.04,95.3 59.09,95.3 U3.11
  Bottom Layer w0.254: v1(86.48,54.41) R105.2
SC_STATUS: length 118.8
  Inner1 w0.254: 85.98,4.5 83.69,6.78 75.95,6.78 73.53,9.19 73.53,20.5 v1(72.26,21.77) ; v1(64.12,94.04) v1(70.87,87.29) ; v1(70.87,66.26) v1(70.87,35.48)
  Inner2 w0.254: v1(70.87,87.29) v1(70.87,66.26) ; v1(70.87,35.48) 72.26,34.09 v1(72.26,21.77)
  Bottom Layer w0.254: R107.1 50.18,93.13 R108.2 R109.2 60.34,94.04 R110.2 v1(64.12,94.04) R111.2
SOFTED_LOW_BATT+: length 152.2
  Top Layer w0.762: C3.1 92.07,82.09 DC/DC1.1
  Bottom Layer w0.762: C2.2 96.21,82.98 DC/DC1.1 89.15,82.98 86.36,85.78 42.29,85.78 38.61,89.46 32.29,89.46 D4.1 17.21,87.68 ; D5.1 17.27,76.25 17.21,76.19
  Bottom Layer w1.524: 软起动PMOS1.2 4.37,59.28 9.65,64.57 12.57,64.57 17.21,69.2 17.21,92.32 18.16,93.27 19.18,93.27 U2.2 U2.1
STEERING_ANGLE: length 18.6
  Inner1 w0.254: CN10.22 89.79,6.27 79.25,16.81 CN1.21
SWED_LOW_BATT+: length 183
  Top Layer w0.762: 91.19,16.05 70.49,16.05 CN1.18 67.82,18.47 65.53,16.18 62.74,16.18 CN1.16 ; 91.19,16.05 CN9.1 ; 91.19,16.05 94.36,19.23 CN9.3 ; 36.96,23.16 35.43,21.64 35.43,17.07 29.46,11.1 24,11.1 CN10.3 CN10.2 CN10.1
  Top Layer w1.524: CN2.10 36.96,23.16 38.99,21.13 57.78,21.13 CN1.16
  Top Layer w2.032: CN2.8 29.34,35.12 34.65,40.44 36.83,40.44 ; 36.83,40.44 36.83,33.07 CN2.10 ; 36.83,40.44 CN5.10
  Bottom Layer w0.254: C1.2 13.64,56.63 R6.2 10.95,53.94 软起动PMOS1.3 9.34,53.61 v1(8.67,54.28)
  Bottom Layer w2.032: 软起动PMOS1.3 13.58,50.98 34.29,50.98 36.83,48.44 CN5.10
TS_OFF-: length 8.2
  Bottom Layer w0.254: NMOS3.3 26.8,23.29 29.72,20.37 CN1.8
TS_OFF_ON: length 126.1
  Inner1 w0.254: v1(92.46,42.22) 94.62,40.06 94.62,35.74 95.25,35.1 95.25,29.9 92.71,27.36 92.71,20.24 91.44,18.97 88.26,18.97 80.87,26.37 v1(51.31,26.37)
  Inner2 w0.254: v1(9.02,26.23) 45.6,26.23 v1(46.09,26.72)
  Bottom Layer w0.254: v1(46.09,26.72) 46.44,26.37 电压比较器4.13 v1(51.31,26.37) 50.66,27.02 电压比较器4.14 ; v1(92.46,42.22) 84.84,42.22 84.13,42.92 NMOS7.1 ; 电压比较器5.5 v1(9.02,26.23)
TSAL_GREEN-: length 27.6
  Bottom Layer w0.254: R96.1 95.12,53.65 95.12,45.39 94.36,44.63 92.58,44.63 91.57,45.64 91.57,48.56 90.04,50.09 88.77,50.09 CN4.2 85.85,44.03 NMOS7.3
TSAL_RED-: length 35.5
  Bottom Layer w0.254: 89.66,45.64 87,42.98 84.96,42.98 84.07,43.87 81.44,43.87 NMOS8.3 ; 89.66,45.64 CN4.3 ; 89.66,45.64 91.69,43.61 94.74,43.61 95.76,44.63 95.76,51.36 97.79,53.39 97.79,57.07 R95.1
VISIBILITY_CHECK: length 40.5
  Inner2 w0.254: v1(8.38,26.88) 8.38,25.83 9.14,25.07 10.03,25.07 v1(10.54,24.56)
  Bottom Layer w0.254: v1(10.54,24.56) 10.83,24.28 电压比较器5.13 17.15,24.28 PMOS2.1 ; PMOS2.1 18.8,28.32 18.8,30.53 19.81,31.55 19.81,36.58 ; PMOS2.1 PMOS3.1 ; 19.81,36.58 19.11,37.29 PMOS4.1 ; 19.81,36.58 PMOS5.1 ; v1(8.38,26.88) 电压比较器5.6 6.95,26.85 R23.1
$1N7046: length 5.2
  Bottom Layer w0.254: R49.1 64.44,11.74 64.51,11.8 64.51,9.81 R50.2
$1N7051: length 16.1
  Bottom Layer w0.254: R53.1 57.13,8.93 R51.2 60.59,8.93 62.1,7.42 69.13,7.42 NMOS6.1
$1N7055: length 4.2
  Bottom Layer w0.254: NMOS6.3 67.03,10.83 R50.1
$1N7061: length 3.3
  Bottom Layer w0.254: U1.5 C5.2
$1N7065: length 7.8
  Bottom Layer w0.254: R11.1 U1.7 83.57,11.23 84.59,12.25 R12.2
$1N7066: length 16.4
  Bottom Layer w0.254: 86.87,11.23 85.6,9.96 C6.2 ; 86.87,11.23 U1.2 ; 86.87,11.23 86.1,12 R12.1
$1N7088: length 13.1
  Bottom Layer w0.254: 电压比较器2.1 电压比较器2.2 89.12,40.21 87.76,41.58 82.58,41.58 NMOS8.1 81.47,38.72 R19.1
$1N7125: length 12.8
  Inner2 w0.254: v1(57.02,38.12) 56.99,38.15 v1(56.99,43.1)
  Bottom Layer w0.254: v1(56.99,43.1) 55.34,44.75 53.66,44.75 C8.1 ; 54.99,38.12 v1(57.02,38.12)
$1N7168: length 4.3
  Bottom Layer w0.254: R91.2 28.57,80.06 ; 28.57,80.06 28.44,80.19 R92.1 ; 28.57,80.06 Q1.1
$1N7173: length 3.9
  Bottom Layer w0.254: R94.1 26.37,68.59 Q2.1 28.57,68.61 R93.2
$1N7180: length 6.7
  Bottom Layer w0.254: R7.2 10.67,58.44 软起动PMOS1.1 15.49,58.15 C1.1
$1N7198: length 29.4
  Inner1 w0.254: U2.10 v1(86.61,72.86) U2.9
  Bottom Layer w0.254: v1(86.61,72.86) 86.57,72.82 R82.1
$1N7199: length 45.9
  Inner1 w0.254: U2.4 U2.3 13.97,91.36 9.91,87.3 SW2.2
$1N7218: length 15.7
  Bottom Layer w0.254: R43.1 74.92,35.48 76.86,35.48 NMOS4.1 81.31,36.66 82.55,37.9 82.55,39.04 83.72,40.21 电压比较器2.13
$1N7224: length 14
  Bottom Layer w0.254: 53.98,74.12 51.79,74.12 50.42,75.49 46.35,75.49 R32.1 44.38,74.91 NMOS1.1
$1N7234: length 23.4
  Bottom Layer w0.254: R30.1 55.43,74.77 52.03,74.77 50.8,76 46.48,76 45.47,77.01 45.47,78.41 44.96,78.92 43.81,78.92 43.43,78.54 43.43,76.12 42.66,75.35 NMOS2.1
$1N7244: length 6.1
  Bottom Layer w0.254: NMOS1.3 43.45,79.93 D1.2 47,80.03 继电器1.8
$1N7245: length 6.9
  Bottom Layer w0.254: NMOS2.3 40.66,69.33 D2.2 45.69,67.83 继电器2.8
$1N7257: length 5.6
  Bottom Layer w0.254: NMOS3.1 21.55,23.16 R26.1 R25.2
$1N7258: length 13.5
  Bottom Layer w0.254: R26.2 16,23.16 15.62,22.78 10.8,22.78 9.3,24.28 电压比较器5.2 4.79,24.28 R36.1
$1N7259: length 14.5
  Bottom Layer w0.254: R25.1 10.92,21.39 8.68,23.63 电压比较器5.1 5.8,23.63 4.69,22.52 R35.1
$1N7273: length 8.1
  Bottom Layer w0.254: 电压比较器5.11 13.72,25.58 R29.1 15.81,27.66 C7.2 15.68,29.64 D3.2
$1N7274: length 2.3
  Bottom Layer w0.254: D3.1 8.12,29.64 R24.1
$1N7300: length 2.2
  Bottom Layer w0.254: R96.2 94.5,56.14 v1(94.07,56.57)
$1N33230: length 2.2
  Bottom Layer w0.254: v1(94.23,60.8) 94.62,60.41 R95.2
$1N45877: length 1.6
  Bottom Layer w0.254: v1(97.06,68.72) 97.06,67.4 R4.1
$1N45932: length 1.8
  Bottom Layer w0.254: R8.1 97.03,63.94 v1(97.03,65.7)
$3N1751: length 4.1
  Bottom Layer w0.254: R22.2 15.82,55.04 v1(15.02,54.23)
$3N1752: length 4.2
  Bottom Layer w0.254: v1(23.14,54.22) 24.34,55.42 R21.2
$3N1753: length 4.5
  Bottom Layer w0.254: v1(31.27,54.22) 32.08,55.04 R20.2
$3N1754: length 4.2
  Top Layer w0.254: v1(43.78,55.55) 41.46,55.55 RING.2
$3N1755: length 1.7
  Top Layer w0.254: v1(49.28,55.93) 49.29,55.93 FRONT.2
$3N1756: length 1.5
  Top Layer w0.254: HV.2 57.46,54.15 v1(56.04,54.15)
$3N1757: length 2
  Top Layer w0.254: v1(65.12,52.38) 65.53,52.79 SIDE.2
$3N1758: length 3.5
  Bottom Layer w0.254: R9.2 74.9,52.5 v1(73.28,54.12)
$3N1759: length 3.5
  Bottom Layer w0.254: R5.2 81.72,54.41 v1(81.53,54.22)
$3N1775: length 1.9
  Bottom Layer w0.254: U3.9 R110.1
$3N1776: length 2.1
  Bottom Layer w0.254: U3.7 R109.1
$3N1777: length 2.1
  Bottom Layer w0.254: U3.6 R108.1
$3N1778: length 1.9
  Bottom Layer w0.254: U3.14 R107.2
$3N6142: length 10.1
  Top Layer w0.254: SWLB+.2 6.57,62.35 v1(5.11,63.81)
$3N6144: length 1.9
  Bottom Layer w0.254: R113.2 R112.1

## Copper pours and planes (outline as drawn; the poured copper is in the pictures)
+5V on Inner1: -5.97,103.56 104.39,103.56 104.39,-2.49 -5.97,-2.49
+24V on Top Layer: -4.83,103.56 103.38,103.56 103.38,-1.73 -4.83,-1.73
+24V on Bottom Layer: -6.48,106.1 105.79,106.1 105.79,-3.12 -6.48,-3.12
GND on Inner2: -5.84,103.68 107.57,103.68 107.57,-6.93 -5.84,-6.93

## Text on the board
Bottom Silkscreen Layer: by:[ ly ]、 [ szy ]、7v、wyt、Eagerrrrr、jfdkldbd | SEUR_V5.0 | 短接 | 非必要不贴
Top Silkscreen Layer: BRK BATT INV
